# Altium schematic sheet EEPROM.SchDoc
size A; SheetNumber: 11; SheetTotal: 16
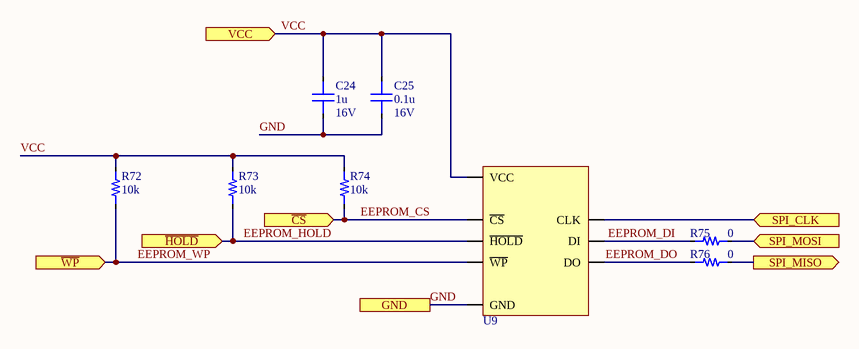
[diagram p0: EEPROM.SchDoc]

## Parts
C24  value 1u  Voltage: 16V  [0603_CAP]  (hidden comment: Capacitor)
C25  value 0.1u  Voltage: 16V  [0603_CAP]  (hidden comment: Capacitor)
R72  value 10k  [0603_RES]  (hidden comment: Resistor)
R73  value 10k  [0603_RES]  (hidden comment: Resistor)
R74  value 10k  [0603_RES]  (hidden comment: Resistor)
R75  value 0  [0603_RES]  (hidden comment: Resistor)
R76  value 0  [0603_RES]  (hidden comment: Resistor)
U9  W25X40CL  [SOIC-8]  (value not drawn)

## Ports
GND, SPI_CLK (in), SPI_MISO (out), SPI_MOSI (in), VCC (in), ~{CS} (in), ~{HOLD} (in), ~{WP} (in)

## Nets
EEPROM_CS: R74.1 U9.1(~{CS}) ; port ~{CS}
EEPROM_DI: R75.1 U9.5(DI)
EEPROM_DO: R76.1 U9.2(DO)
EEPROM_HOLD: R73.1 U9.7(~{HOLD}) ; port ~{HOLD}
EEPROM_WP: R72.1 U9.3(~{WP}) ; port ~{WP}
GND: C24.1 C25.1 U9.4(GND) ; port GND
SPI_CLK: U9.6(CLK) ; port SPI_CLK
SPI_MISO: R76.2 ; port SPI_MISO
SPI_MOSI: R75.2 ; port SPI_MOSI
VCC: C24.2 C25.2 R72.2 R73.2 R74.2 U9.8(VCC) ; port VCC

## Library data of the parts
U9 = W25X40CL: FLASH Memory IC 4Mbit SPI 104 MHz 8-SOIC; Num_Circuits: 1; Voltage: 5; ComponentLink1Description: Digikey; ComponentLink1URL: https://www.digikey.com/en/products/detail/winbond-electronics/W25X40CLSNIG/3008652
C24 C25 = Capacitor: Dielectric: *; Percent Tolerance: *; ESR: *
R72-R76 = Resistor: Tolerance: *